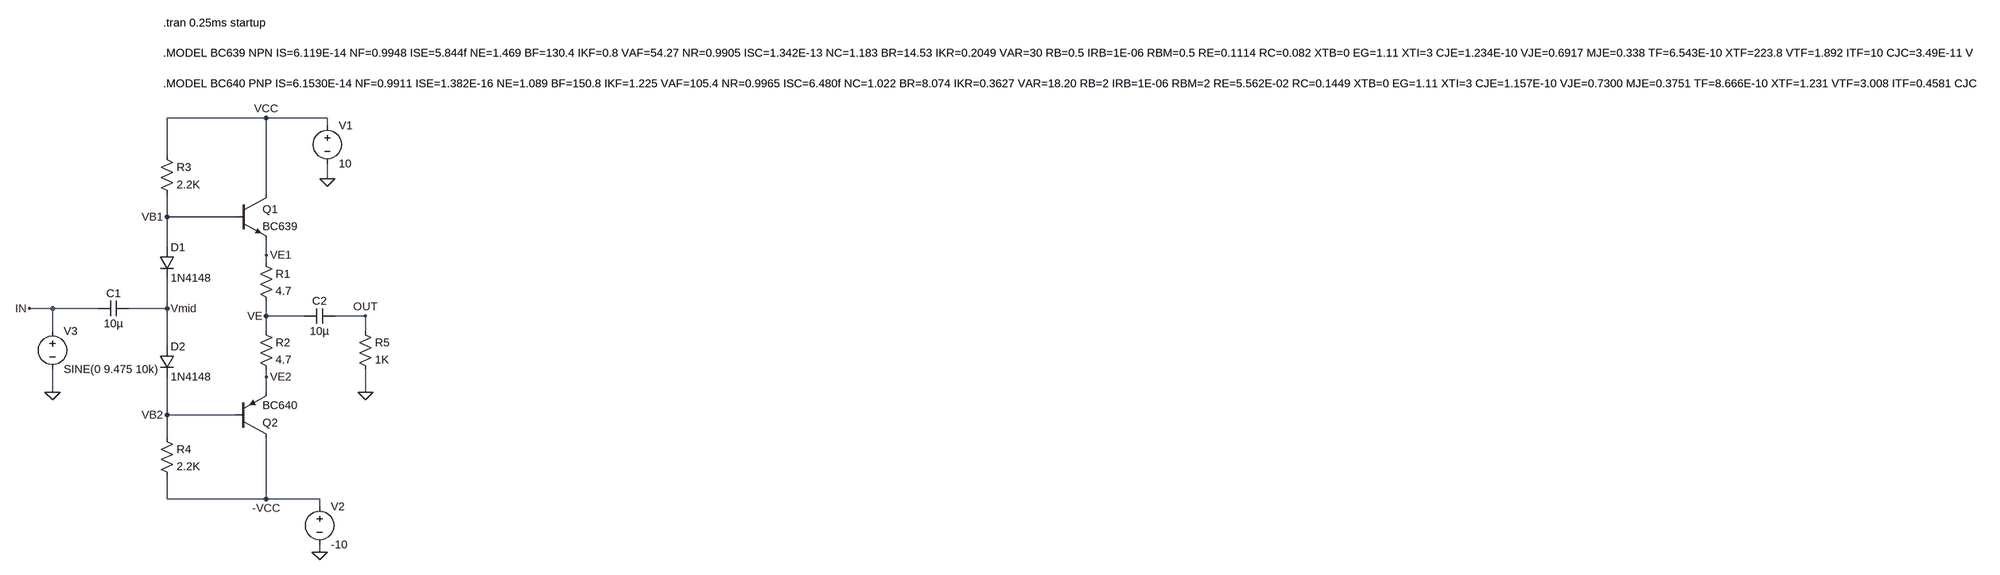
[diagram p0: schematic Simulation3 AC_Analysis.asc]
Simulation3 AC_Analysis.asc, the LTspice schematic file:
Version 4
SHEET 1 5568 872
WIRE 256 -160 48 -160
WIRE 384 -160 256 -160
WIRE 384 -144 384 -160
WIRE 48 -80 48 -160
WIRE 384 -32 384 -64
WIRE 256 0 256 -160
WIRE 48 48 48 0
WIRE 192 48 48 48
WIRE 48 112 48 48
WIRE 256 128 256 96
WIRE 256 144 256 128
WIRE -192 240 -240 240
WIRE -96 240 -192 240
WIRE 48 240 48 176
WIRE 48 240 -32 240
WIRE 256 256 256 224
WIRE 336 256 256 256
WIRE 464 256 400 256
WIRE -192 288 -192 240
WIRE 256 288 256 256
WIRE 464 288 464 256
WIRE 48 320 48 240
WIRE 256 384 256 368
WIRE -192 416 -192 368
WIRE 256 416 256 384
WIRE 464 416 464 368
WIRE 48 464 48 384
WIRE 192 464 48 464
WIRE 48 512 48 464
WIRE 48 640 48 592
WIRE 256 640 256 512
WIRE 256 640 48 640
WIRE 368 640 256 640
WIRE 368 656 368 640
WIRE 368 752 368 736
FLAG 464 416 0
FLAG 464 256 OUT
FLAG 384 -32 0
FLAG 368 752 0
FLAG -240 240 IN
FLAG 48 48 VB1
FLAG 48 464 VB2
FLAG 256 256 VE
FLAG 256 -160 VCC
FLAG 256 640 -VCC
FLAG 256 128 VE1
FLAG 256 384 VE2
FLAG 48 240 Vmid
FLAG -192 416 0
SYMBOL res 32 -96 R0
SYMATTR InstName R3
SYMATTR Value 2.2K
SYMBOL res 32 496 R0
SYMATTR InstName R4
SYMATTR Value 2.2K
SYMBOL res 240 272 R0
SYMATTR InstName R2
SYMATTR Value 4.7
SYMBOL res 240 128 R0
SYMATTR InstName R1
SYMATTR Value 4.7
SYMBOL res 448 272 R0
SYMATTR InstName R5
SYMATTR Value 1K
SYMBOL cap -32 224 R90
WINDOW 0 0 32 VBottom 2
WINDOW 3 32 32 VTop 2
SYMATTR InstName C1
SYMATTR Value 10µ
SYMBOL cap 400 240 R90
WINDOW 0 0 32 VBottom 2
WINDOW 3 32 32 VTop 2
SYMATTR InstName C2
SYMATTR Value 10µ
SYMBOL diode 32 112 R0
SYMATTR InstName D1
SYMATTR Value 1N4148
SYMBOL diode 32 320 R0
SYMATTR InstName D2
SYMATTR Value 1N4148
SYMBOL npn 192 0 R0
SYMATTR InstName Q1
SYMATTR Value BC639
SYMBOL voltage 384 -160 R0
WINDOW 123 0 0 Left 0
WINDOW 39 0 0 Left 0
SYMATTR InstName V1
SYMATTR Value 10
SYMBOL voltage 368 640 R0
WINDOW 123 0 0 Left 0
WINDOW 39 0 0 Left 0
SYMATTR InstName V2
SYMATTR Value -10
SYMBOL pnp 192 512 M180
SYMATTR InstName Q2
SYMATTR Value BC640
SYMBOL voltage -192 272 R0
WINDOW 123 0 0 Left 0
WINDOW 39 0 0 Left 0
SYMATTR InstName V3
SYMATTR Value SINE(0 9.475 10k)
TEXT 40 -296 Left 2 !.MODEL BC639 NPN IS=6.119E-14 NF=0.9948 ISE=5.844f NE=1.469 BF=130.4 IKF=0.8 VAF=54.27 NR=0.9905 ISC=1.342E-13 NC=1.183 BR=14.53 IKR=0.2049 VAR=30 RB=0.5 IRB=1E-06 RBM=0.5 RE=0.1114 RC=0.082 XTB=0 EG=1.11 XTI=3 CJE=1.234E-10 VJE=0.6917 MJE=0.338 TF=6.543E-10 XTF=223.8 VTF=1.892 ITF=10 CJC=3.49E-11 VJC=0.5 MJC=0.388 XCJC=0.15 TR=10n FC=0.9232
TEXT 40 -232 Left 2 !.MODEL BC640 PNP IS=6.1530E-14 NF=0.9911 ISE=1.382E-16 NE=1.089 BF=150.8 IKF=1.225 VAF=105.4 NR=0.9965 ISC=6.480f NC=1.022 BR=8.074 IKR=0.3627 VAR=18.20 RB=2 IRB=1E-06 RBM=2 RE=5.562E-02 RC=0.1449 XTB=0 EG=1.11 XTI=3 CJE=1.157E-10 VJE=0.7300 MJE=0.3751 TF=8.666E-10 XTF=1.231 VTF=3.008 ITF=0.4581 CJC=5.264E-11 VJC=0.6591 MJC=0.4533 XCJC=0.4401 TR=2.75E-07 FC=0.9427
TEXT 40 -360 Left 2 !.tran 0.25ms startup

The netlist it stands for:
* Simulation3 AC_Analysis.asc
R3 VCC VB1 2.2K
R4 VB2 -VCC 2.2K
R2 VE VE2 4.7
R1 VE1 VE 4.7
R5 OUT 0 1K
C1 Vmid IN 10µ
C2 OUT VE 10µ
D1 VB1 Vmid 1N4148
D2 Vmid VB2 1N4148
Q1 VCC VB1 VE1 0 BC639
V1 VCC 0 10
V2 -VCC 0 -10
Q2 -VCC VB2 VE2 0 BC640
V3 IN 0 SINE(0 9.475 10k)
.model D D
.lib standard.dio
.model NPN NPN
.model PNP PNP
.lib standard.bjt
.MODEL BC639 NPN IS=6.119E-14 NF=0.9948 ISE=5.844f NE=1.469 BF=130.4 IKF=0.8 VAF=54.27 NR=0.9905 ISC=1.342E-13 NC=1.183 BR=14.53 IKR=0.2049 VAR=30 RB=0.5 IRB=1E-06 RBM=0.5 RE=0.1114 RC=0.082 XTB=0 EG=1.11 XTI=3 CJE=1.234E-10 VJE=0.6917 MJE=0.338 TF=6.543E-10 XTF=223.8 VTF=1.892 ITF=10 CJC=3.49E-11 VJC=0.5 MJC=0.388 XCJC=0.15 TR=10n FC=0.9232
.MODEL BC640 PNP IS=6.1530E-14 NF=0.9911 ISE=1.382E-16 NE=1.089 BF=150.8 IKF=1.225 VAF=105.4 NR=0.9965 ISC=6.480f NC=1.022 BR=8.074 IKR=0.3627 VAR=18.20 RB=2 IRB=1E-06 RBM=2 RE=5.562E-02 RC=0.1449 XTB=0 EG=1.11 XTI=3 CJE=1.157E-10 VJE=0.7300 MJE=0.3751 TF=8.666E-10 XTF=1.231 VTF=3.008 ITF=0.4581 CJC=5.264E-11 VJC=0.6591 MJC=0.4533 XCJC=0.4401 TR=2.75E-07 FC=0.9427
.tran 0.25ms startup
.backanno
.end